# Altium project PCB_Project.PrjPcb
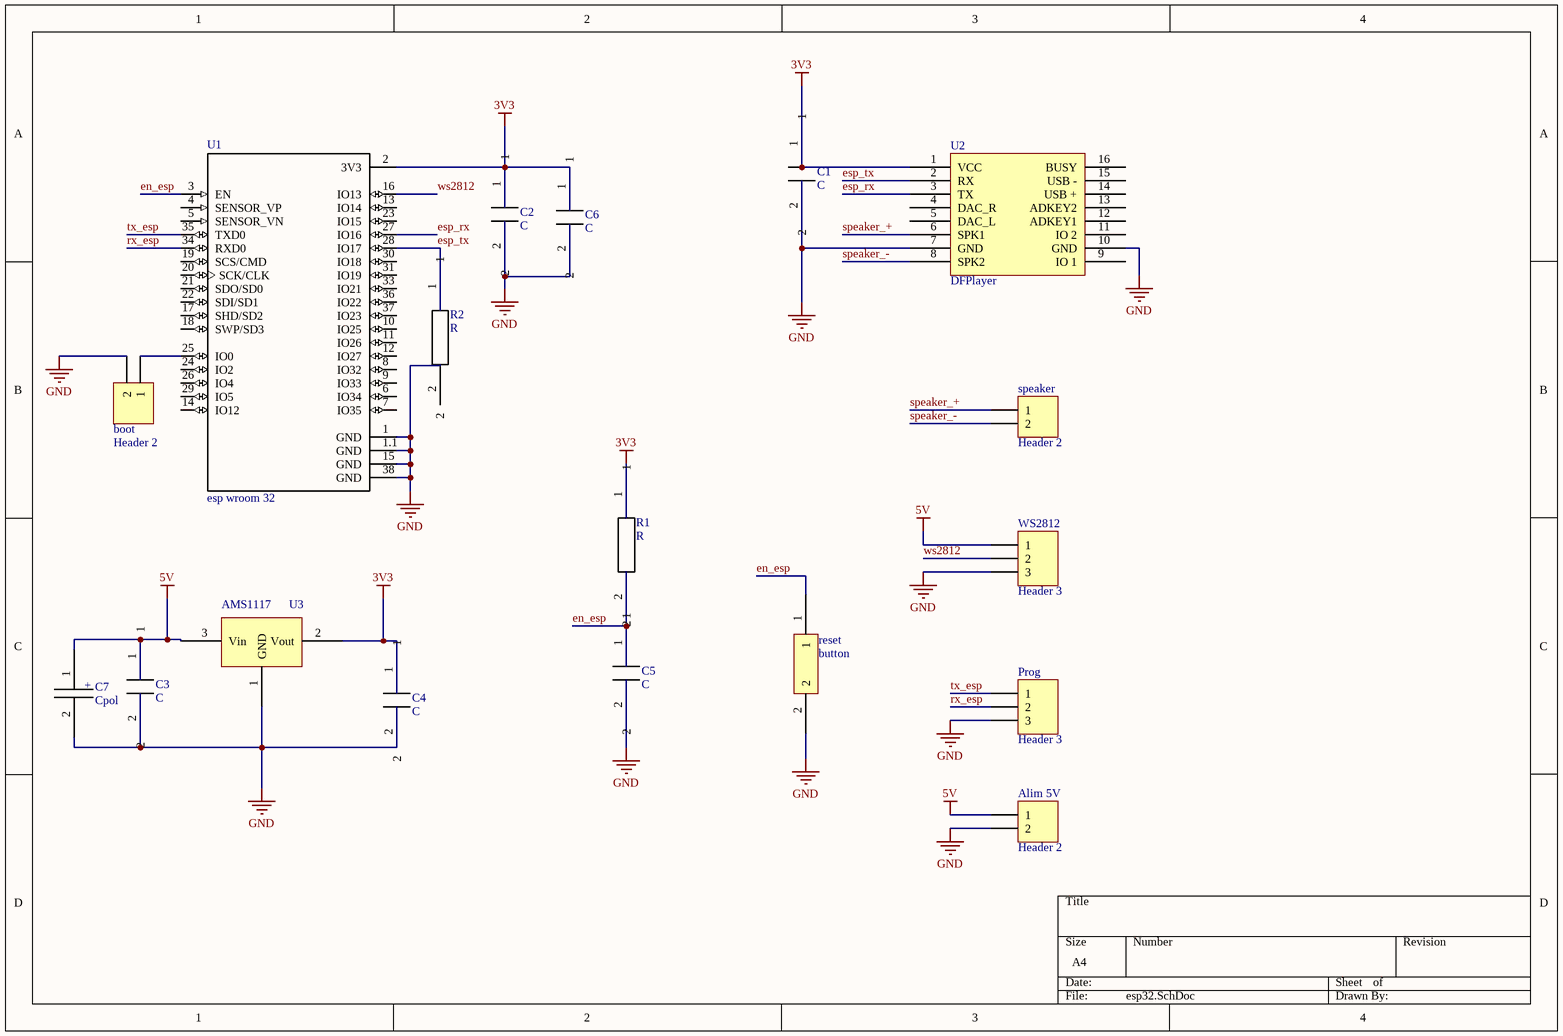
[diagram p0: esp32.SchDoc]
1 sheet, 18 parts. Net scope: global (net labels, ports and power ports of the same name join across sheets).
Board file: PCB1.PcbDoc

## Sheet esp32.SchDoc
size A4

### Parts
Alim_5V  Header 2  [HDR1X2]
boot  Header 2  [HDR1X2]
C1  C  [CAP 0805]
C2  C  [CAP 0805]
C3  C  [CAP 0805]
C4  C  [CAP 0805]
C5  C  [CAP 0805]
C6  C  [CAP 0805]
C7  Cpol  [SMD_capacitor]
Prog  Header 3  [HDR1X3]
R1  R  [RES 0805]
R2  R  [RES 0805]
reset  button  [button_pcb]
speaker  Header 2  [HDR1X2]
U1  esp wroom 32  [esp32]
U2  DFPlayer  [DFPlayer]
U3  AMS1117  [SOT229P700X180-4N]
WS2812  Header 3  [HDR1X3]

### Nets
3V3: C1.1 C2.1 C4.1 C6.1 R1.1 U1.2(3V3) U2.1(VCC) U3.2(Vout)
5V: Alim_5V.1 C3.1 C7.1 U3.3(Vin) WS2812.1
GND: Alim_5V.2 boot.2 C1.2 C2.2 C3.2 C4.2 C5.2 C6.2 C7.2 Prog.3 R2.2 reset.2 U1.1(GND) U1.1.1(GND) U1.15(GND) U1.38(GND) U2.7(GND) U2.10(GND) U3.1(GND) WS2812.3
en_esp: C5.1 R1.2 reset.1 U1.3(EN)
esp_rx: U1.27(IO16) U2.3(TX)
esp_tx: R2.1 U1.28(IO17) U2.2(RX)
rx_esp: Prog.2 U1.34(RXD0)
speaker_+: speaker.1 U2.6(SPK1)
speaker_-: speaker.2 U2.8(SPK2)
tx_esp: Prog.1 U1.35(TXD0)
ws2812: U1.16(IO13) WS2812.2
Netboot_1: boot.1 U1.25(IO0)

Not connected (* = marked no-connect by the designer): U1 4(SENSOR_VP) 5(SENSOR_VN) 6(IO34) 7(IO35) 8(IO32) 9(IO33) 10(IO25) 11(IO26) 12(IO27) 13(IO14) 14(IO12) 17(SHD/SD2) 18(SWP/SD3) 19(SCS/CMD) 20(SCK/CLK) 21(SDO/SD0) 22(SDI/SD1) 23(IO15) 24(IO2) 26(IO4) 29(IO5) 30(IO18) 31(IO19) 33(IO21) 36(IO22) 37(IO23); U2 4(DAC_R) 5(DAC_L) 9(IO_1) 11(IO_2) 12(ADKEY1) 13(ADKEY2) 14(USB_+) 15(USB_-) 16(BUSY)

### Notes on the sheet
- (in symbol Cpol) +

### Library data of the parts
Alim_5V boot speaker = Header 2: Header, 2-Pin; LatestRevisionDate: 17-Jul-2002; LatestRevisionNote: Re-released for DXP Platform.; Publisher: Altium Limited
Prog WS2812 = Header 3: Header, 3-Pin; LatestRevisionDate: 17-Jul-2002; LatestRevisionNote: Re-released for DXP Platform.; Publisher: Altium Limited
U1 = esp wroom 32: ESP32-WROOM-32 generic Wi-Fi+BT+BLE MCU module; ComponentLink1Description: product_page; ComponentLink1URL: https://www.espressif.com/sites/default/files/documentation/esp32-wroom-32_datasheet_en.pdf
U2 = DFPlayer: serial MP3 module
U3 = AMS1117: 1A LOW DROPOUT VOLTAGE REGULATOR

## Assembly variants
Variant of PCB_Project: not fitted R2